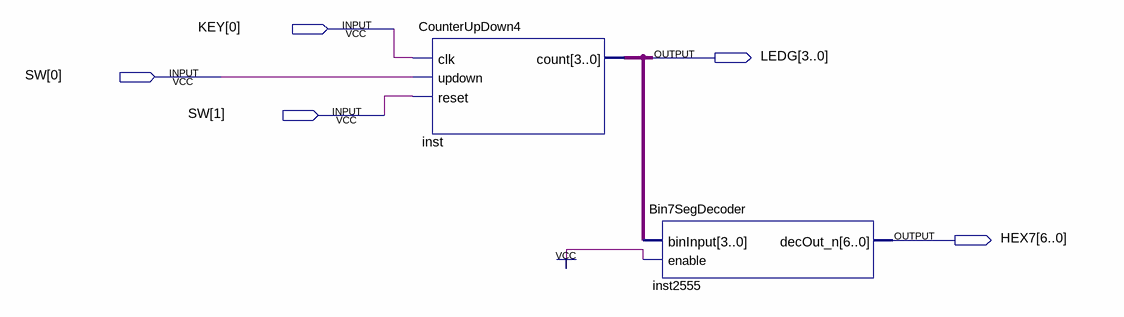
[diagram p0: schematic sheet]
// Quartus schematic Counter_Demo.bdf as structural Verilog: 2 symbols, 5 pins
module Counter_Demo (
  input  [0:0] KEY,
  input  [1:0] SW,
  output [3:0] LEDG,
  output [6:0] HEX7
);

  CounterUpDown4 inst (.clk(KEY[0]), .updown(SW[0]), .reset(SW[1]), .count(LEDG));
  Bin7SegDecoder inst2555 (.binInput(LEDG), .enable(1'b1), .decOut_n(HEX7));
endmodule
